# Altium schematic sheet SD.SchDoc
size B; SheetNumber: 5; SheetTotal: 7
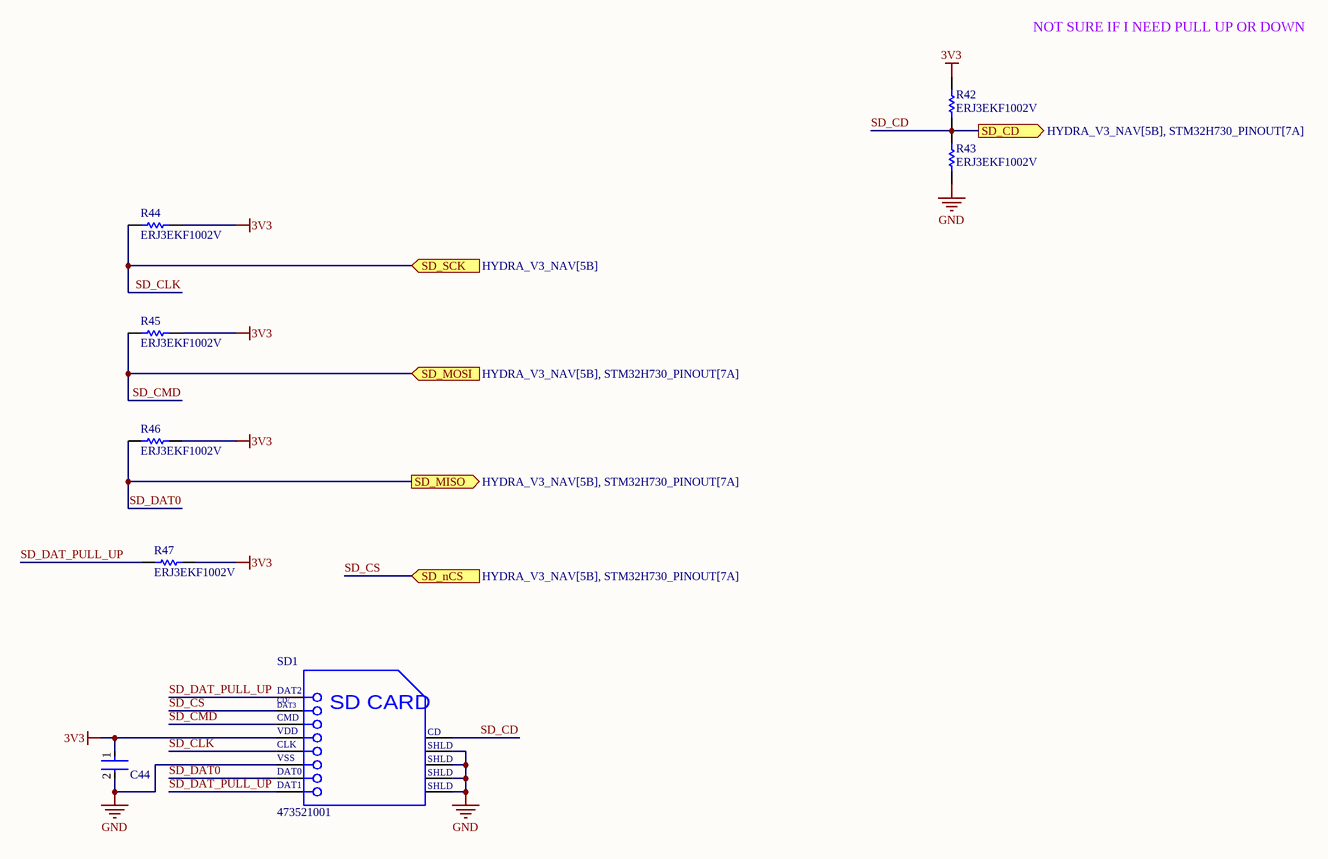
[diagram p0: SD.SchDoc]

## Parts
C44  C0402C104K8PACTU  [FP-C0402-BB-MFG]  (value not drawn)
R42  ERJ3EKF1002V  [RESC1609X55X30LL15T15]
R43  ERJ3EKF1002V  [RESC1609X55X30LL15T15]
R44  ERJ3EKF1002V  [RESC1609X55X30LL15T15]
R45  ERJ3EKF1002V  [RESC1609X55X30LL15T15]
R46  ERJ3EKF1002V  [RESC1609X55X30LL15T15]
R47  ERJ3EKF1002V  [RESC1609X55X30LL15T15]
SD1  473521001  [MOLX-473521001_V]

## Ports
SD_CD (out, see HYDRA_V3_NAV[5B], STM32H730_PINOUT[7A]), SD_MISO (out, see HYDRA_V3_NAV[5B], STM32H730_PINOUT[7A]), SD_MOSI (in, see HYDRA_V3_NAV[5B], STM32H730_PINOUT[7A]), SD_nCS (in, see HYDRA_V3_NAV[5B], STM32H730_PINOUT[7A]), SD_SCK (in, see HYDRA_V3_NAV[5B])

## Nets
3V3: C44.1 R42.2 R44.2 R45.2 R46.2 R47.2 SD1.4(VDD)
GND: C44.2 R43.1 SD1.6(VSS) SD1.10(SHLD) SD1.11(SHLD) SD1.12(SHLD) SD1.13(SHLD)
SD_CD: R42.1 R43.2 SD1.9(CD) ; port SD_CD
SD_CLK: R44.1 SD1.5(CLK) ; port SD_SCK
SD_CMD: R45.1 SD1.3(CMD) ; port SD_MOSI
SD_CS: SD1.2(CD/DAT3) ; port SD_nCS
SD_DAT0: R46.1 SD1.7(DAT0) ; port SD_MISO
SD_DAT_PULL_UP: R47.1 SD1.1(DAT2) SD1.8(DAT1)

## Notes on the sheet
- NOT SURE IF I NEED PULL UP OR DOWN
- (in symbol CMP-2000-05848-1) CD/; DAT3; SD CARD

## Library data of the parts
C44 = CMP-2008-02046-2: CAP CER 0.1UF 10V X5R 0402; Manufacturer: Kemet; Material: Ceramic; Capacitance: 0.10 μF; Temperature Coefficient: 15%; Tolerance: 0.1; Value: 0.10 μF; Package: C0402-BB; Temperature: -55°C to +125°C; ComponentLink2Description: Datasheet; Temperature Characteristic: X5R; Device Class L1: Passive Components; Height: 0.55mm; Lead Free: Yes; ComponentLink2URL: https://content.kemet.com/datasheets/KEM_C1002_X7R_SMD.pdf; Device Class L2: Capacitors; Temperature Range Low: -55°C; Temperature Range High: +125°C; RoHS: TRUE; Octopart: https://octopart.com/c0402c104k8pactu-kemet-140039; Automotive: No; Mouser Description: Capacitor 100 nF 10 VDC 0402; Category: Cap; Voltage Rating: 10 V; Digikey Description: CAP CER 0.1UF 10V X5R 0402; Ipc Land Pattern Name: CAPC10050X50; Device Class L3: Ceramic Capacitors; Manufacturer Part Number: C0402C104K8PACTU
R42-R47 = CMP-1012-00623-3: Chip Resistor, 10 KOhm, +/- 1%, 0.1 W, -55 to 155 degC, 0603 (1608 Metric), RoHS, Tape and Reel; Manufacturer: Panasonic; Voltage Rating: 75V; Case\/Package: 0603; Power Rating: 100mW; Resistance: 10KOhm; Temperature Coefficient: 100ppm\/degreesC; Number of Pins: 2; Package Reference: 603; Depth: 0.8mm; Mount: SurfaceMount; Package Description: 2-Pin Surface Mount Device, Body 1.6 x 0.85 mm; Datasheet Version: 02/2017; Length: 1.6mm; Lead Free: LeadFree; Height: 0.45mm; Number of Terminations: 2; Max Power Dissipation: 100mW; Min Operating Temperature: -55degC; Datasheet URL: https://industrial.panasonic.com/cdbs/www-data/pdf/RDA0000/AOA0000C304.pdf; Termination: SMD/SMT; Case Code (Metric): 1608; Case Code (Imperial): 0603; Tolerance: 1%; Max Operating Temperature: 155degC; RoHSCompliant: true; Voltage Rating (DC): 75V; Radiation Hardening: No; Packaging: TapeandReel; Composition: ThickFilm; Mounting Technology: SurfaceMount; Manufacturer URL: http://www.panasonic.com/; Width: 0.031inch; REACH SVHC: NoSVHC; Contact Plating: Tin; Military Standard: Not; Package Quantity: 1
SD1 = CMP-2000-05848-1: MicroSD(TM), Pitch 1.1 mm, 8 Position, Height 1.88 mm, -20 to 85 degC, RoHS, Tape and Reel; Manufacturer: Molex; Datasheet Version: Rev. G, 01/2012; Datasheet URL: http://www.molex.com/pdm_docs/sd/473521001_sd.pdf; Package Reference: 473521001; Manufacturer URL: http://www.molex.com/; Mounting Technology: SurfaceMount; Package Description: MicroSD(TM), Pitch 1.1 mm, 8 Position, Height 1.88 mm